# EAGLE design TickTag-UIB (EAGLE 9.5.2)
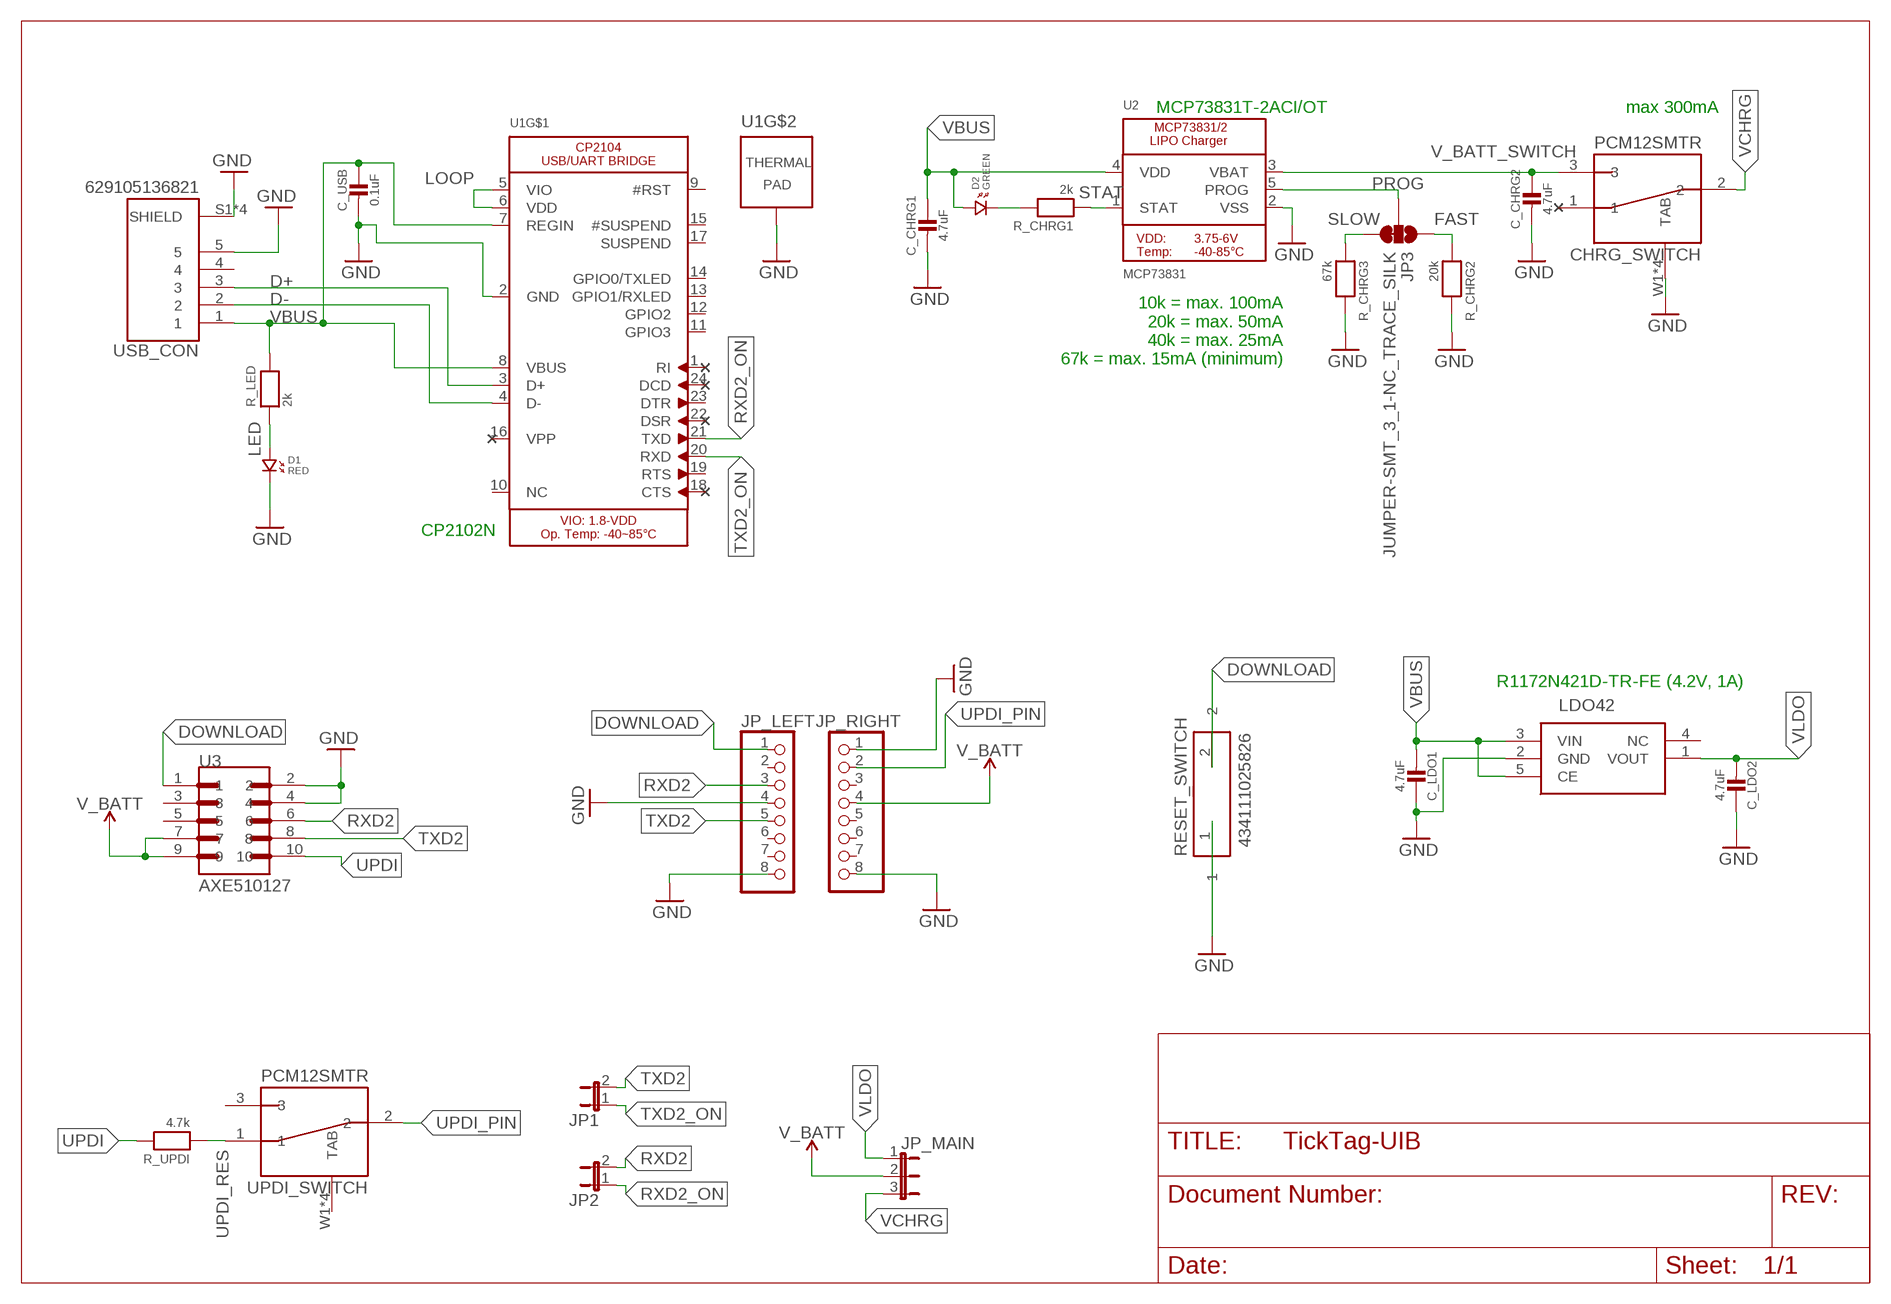
[diagram p0: schematic, sheet 1]

## Parts
C_CHRG1  4.7uF  MICROBUILDER_CAP_CERAMIC_0402MP  [MICROBUILDER__0402MP]
C_CHRG2  4.7uF  MICROBUILDER_CAP_CERAMIC_0402MP  [MICROBUILDER__0402MP]
C_LDO1  4.7uF  MICROBUILDER_CAP_CERAMIC_0402MP  [MICROBUILDER__0402MP]
C_LDO2  4.7uF  MICROBUILDER_CAP_CERAMIC_0402MP  [MICROBUILDER__0402MP]
C_USB  0.1uF  MICROBUILDER_CAP_CERAMIC_0402MP  [MICROBUILDER__0402MP]
CHRG_SWITCH  PCM12SMTR  AS-ITM-00220  [PCM12SMTR]
D1  RED  CMONR_STANDARDPARTS_LED.0402  [CMONR_STANDARDPARTS_0402.LED]
D2  GREEN  CMONR_STANDARDPARTS_LED.0402  [CMONR_STANDARDPARTS_0402.LED]
JP1  JP1E  [JP1]
JP2  JP1E  [JP1]
JP3  JUMPER-SMT_3_1-NC_TRACE_SILK  [SMT-JUMPER_3_1-NC_TRACE_SILK]
JP_LEFT  PINHD-1X8BIG  [1X08-BIG]
JP_MAIN  JP2E  [JP2]
JP_RIGHT  PINHD-1X8BIG  [1X08-BIG]
LDO42  R1172N421D-TR-FE  [R1172N421D-TR-FE]
R_CHRG1  2k  MICROBUILDER_RESISTOR_0402MP  [MICROBUILDER__0402MP]
R_CHRG2  20k  MICROBUILDER_RESISTOR_0402MP  [MICROBUILDER__0402MP]
R_CHRG3  67k  MICROBUILDER_RESISTOR_0402MP  [MICROBUILDER__0402MP]
R_LED  2k  MICROBUILDER_RESISTOR_0402MP  [MICROBUILDER__0402MP]
R_UPDI  4.7k  MICROBUILDER_RESISTOR_0402MP  [MICROBUILDER__0402MP]
RESET_SWITCH  434111025826  [434111025826]
U1  CP2104_MICROBUILDER_CP2104  [CP2104_MICROBUILDER_QFN24_4MM_SMSC]
U2  MCP73831  MICROBUILDER_MCP73831/2  [MICROBUILDER_SOT23-5]
U3  AXE510127  [AXE510127]
UPDI_SWITCH  PCM12SMTR  AS-ITM-00220  [PCM12SMTR]
USB_CON  629105136821  [WE_629105136821]

## Nets
D+: U1.3(D+) USB_CON.3
D-: U1.4(D-) USB_CON.2
DOWNLOAD: JP_LEFT.1 RESET_SWITCH.2 U3.1
FAST: JP3.1 R_CHRG2.1
GND: C_CHRG1.2 C_CHRG2.2 C_LDO1.1 C_LDO2.1 C_USB.2 CHRG_SWITCH.W1(TAB) CHRG_SWITCH.W2(TAB) CHRG_SWITCH.W3(TAB) CHRG_SWITCH.W4(TAB) D1.P$2 JP_LEFT.4 JP_LEFT.8 JP_RIGHT.1 JP_RIGHT.8 LDO42.2(GND) R_CHRG2.2 R_CHRG3.2 RESET_SWITCH.1 U1.2(GND) U1.THERM(TP) U2.2(VSS) U3.2 U3.4 USB_CON.5 USB_CON.S1(SHIELD) USB_CON.S2(SHIELD) USB_CON.S3(SHIELD) USB_CON.S4(SHIELD)
LED: D1.P$1 R_LED.1
LOOP: U1.5(VIO) U1.6(VDD)
PROG: JP3.2 U2.5(PROG)
RXD2: JP2.2 JP_LEFT.3 U3.6
RXD2_ON: JP2.1 U1.21(TXD)
SLOW: JP3.3 R_CHRG3.1
STAT: R_CHRG1.1 U2.1(STAT)
STAT_BTW: D2.P$2 R_CHRG1.2
TXD2: JP1.2 JP_LEFT.5 U3.8
TXD2_ON: JP1.1 U1.20(RXD)
UPDI: R_UPDI.2 U3.10
UPDI_PIN: JP_RIGHT.2 UPDI_SWITCH.2
UPDI_RES: R_UPDI.1 UPDI_SWITCH.1
V_BATT: JP_MAIN.2 JP_RIGHT.4 U3.7 U3.9
V_BATT_SWITCH: C_CHRG2.1 CHRG_SWITCH.3 U2.3(VBAT)
VBUS: C_CHRG1.1 C_LDO1.2 C_USB.1 D2.P$1 LDO42.3(VIN) LDO42.5(CE) R_LED.2 U1.7(REGIN) U1.8(VBUS) U2.4(VDD) USB_CON.1
VCHRG: CHRG_SWITCH.2 JP_MAIN.3
VLDO: C_LDO2.2 JP_MAIN.1 LDO42.1(VOUT)
Unconnected: CHRG_SWITCH.1 JP_LEFT.2 JP_LEFT.6 JP_LEFT.7 JP_RIGHT.3 JP_RIGHT.5 JP_RIGHT.6 JP_RIGHT.7 LDO42.4(NC) U1.1(RI) U1.9(#RST) U1.10(NC) U1.11(GPIO3) U1.12(GPIO2) U1.13(GPIO1/RXLED) U1.14(GPIO0/TXLED) U1.15(#SUSPEND) U1.16(VPP) U1.17(SUSPEND) U1.18(CTS) U1.19(RTS) U1.22(DSR) U1.23(DTR) U1.24(DCD) U3.3 U3.5 UPDI_SWITCH.3 UPDI_SWITCH.W1(TAB) UPDI_SWITCH.W2(TAB) UPDI_SWITCH.W3(TAB) UPDI_SWITCH.W4(TAB) USB_CON.4

## Notes on the sheet
- MCP73831T-2ACI/OT | max 300mA
- 10k = max. 100mA
  20k = max. 50mA
  40k = max. 25mA
  67k = max. 15mA (minimum)
- CP2102N
- R1172N421D-TR-FE (4.2V, 1A)

## Library data of the parts
C_CHRG1 C_CHRG2 C_LDO1 C_LDO2 C_USB = TinyPICO:MICROBUILDER_CAP_CERAMIC: Ceramic Capacitors For new designs, use the packages preceded by an '_' character since they are more reliable: The following footprints should be used on most boards: _0402 - Standard footprint for regular board layouts _0603 - Standard footprint for regular board layouts _0805 - Standard footprint for regular board layouts _1206 - Standard footprint for regular board layouts For extremely tight-pitch boards where space is at a premium, the following 'micro-pitch' footprints can be used (smaller pads, no silkscreen outline, etc.): _0402MP - Micro-pitch footprint for very dense/compact boards _0603MP - Micro-pitch footprint for very dense/compact boards _0805MP - Micro-pitch footprint for very dense/compact boards _1206MP - Micro-pitch footprint for very dense/compact boards
CHRG_SWITCH UPDI_SWITCH = tinycircuits:AS-ITM-00220: SW SLIDE SP2T 6VDC 0.3A SMT; PARTNO: AS-ITM-00220
D1 D2 = TinyPICO:CMONR_STANDARDPARTS_LED
JP1 JP2 = jumper:JP1E: JUMPER
JP3 = SparkFun-Jumpers:JUMPER-SMT_3_1-NC_TRACE: Normally closed trace jumper (1 of 2 connections) This jumper has a trace between two pads so it's normally closed (NC). The other connection is normally open (NO). Use a razor knife to open the connection. For best results follow the IPC guidelines for cutting traces: Cutout at least 0.063 mm (0.005 in). Remove all loose material to clean up the cut area. Seal the cut with an approved epoxy. Reapply solder to reclose the connection, or to close the NO connection.
JP_LEFT JP_RIGHT = adafruit:PINHD-1X8: PIN HEADER
JP_MAIN = jumper:JP2E: JUMPER
LDO42 = R1172N421D-TR-FE:R1172N421D-TR-FE: Low Dropout Regulators(LDO) SOT-23-5 RoHS Source: Datasheet <https://datasheet.lcsc.com/szlcsc/1809291540_Holtek-Semicon-HT7833_C164106.pdf>; DESCRIPTION: Low Dropout Regulators(LDO) SOT-23-5 RoHS; HEIGHT: 0.8mm; MANUFACTURER_NAME: Holtek; MANUFACTURER_PART_NUMBER: HT7833
R_CHRG1-R_CHRG3 R_LED R_UPDI = TinyPICO:MICROBUILDER_RESISTOR: Resistors 0402 - 0402 Surface Mount Package 22 Ohm 1% 1/16W [Digikey: 311-22.0LRTR-ND] 33 Ohm 5% 1/16W 1.0K 5% 1/16W 1.5K 5% 1/16W 2.0K 1% 1/16W 10.0K 1% 1/16W [Digikey: 311-10.0KLRTR-ND] 10.0K 5% 1/16W [Digikey: RMCF0402JT10K0TR-ND] 12.1K 1% 1/16W [Digikey: 311-22.0LRTR-ND] 100.0K 5% 1/16W 0603 - 0603 Surface Mount Package 0 Ohm 1/10 Watt 1% Resistor 15 Ohm 1/10 Watt 1% Resistor 33 Ohm 1/10 Watt 1% Resistor 49.9 Ohm 1/10 Watt 1% Resistor 100 Ohm 1/10 Watt 1% Resistor 150 Ohm 1/10 Watt 1% Resistor 240 Ohm 1/10 Watt 1% Resistor 390 Ohm 1/10 Watt 1% Resistor 560 Ohm 1/10 Watt 1% Resistor 680 Ohm 1/10 Watt 1% Resistor 750 Ohm 1/10 Watt 1% Resistor 1.0K Ohm 1/10 Watt 1% Resistor 1.5K Ohm 1/10 Watt 1% Resistor 2.0K Ohm 1/10 Watt 1% Resistor 2.2K Ohm 1/10 Watt 1% Resistor 3.3K Ohm 1/10 Watt 1% Resistor 4.7K Ohm 1/10 Watt 1% Resistor 10.0K Ohm 1/10 Watt 1% Resistor 12.0K Ohm 1/10 Watt 1% Resistor 12.1K Ohm 1/10 Watt 1% Resistor 20.0K Ohm 1/10 Watt 1% Resistor 33.0K Ohm 1/10 Watt 1% Resistor 100.0K Ohm 1/10 Watt 1% Resistor 0805 - 0805 Surface Mount Package 0 Ohm 1/8 Watt 1% Resistor 33 Ohm 1/8 Watt 1% Resistor 100 Ohm 1/8 Watt 1% Resistor 150 Ohm 1/8 Watt 1% Resistor 200 Ohm 1/8 Watt 1% Resistor 240 Ohm 1/8 Watt 1% Resistor 330 Ohm 1/8 Watt 1% Resistor 390 Ohm 1/8 Watt 1% Resistor 470 Ohm 1/8 Watt 1% Resistor 1.0K Ohm 1/8 Watt 1% Resistor 1.5K Ohm 1/8 Watt 1% Resistor 2.0K Ohm 1/8 Watt 1% Resistor 4.7K Ohm 1/8 Watt 1% Resistor 5.1K Ohm 1/8 Watt 1% Resistor 5.6K Ohm 1/8 Watt 1% Resistor 10.0K Ohm 1/8 Watt 1% Resistor 22.0K Ohm 1/8 Watt 1% Resistor 33.0K Ohm 1/8 Watt 1% Resistor 100K Ohm 1/8 Watt 1% Resistor 1206 - 1206 Surface Mount Package 2012 - 2010 Surface Mount Package 0.11 Ohm 1/2 Watt 1% Resistor - Digikey: RHM.11UCT-ND
RESET_SWITCH = Wurth_Elektronik_Electromechanic_Switchs_rev15b:434111025826: WS-TRS-6x3.8 mm SMD Tact Switch, 2 pins
U1 = TinyPICO:CP2104_MICROBUILDER_CP2104: CP2104 - USB to UART Bridge VDD Output: 3.45V
U2 = TinyPICOV2:MICROBUILDER_MCP73831/2: MCP73831/2 LIPO Charger VDD: 3.75 - 6V Temp -40 - 85°C Programmable Charge Rate: 15-500mA NOTE: STAT is a tri-state logic output on the MCP73831 and an open-drain output on the MCP73832. SOT23-5 with 4.2V output and tri-state logic on STAT = MCP73831T-2ACI/OT
U3 = PanasonicA4SConnectorsV4_CreamAdjust:AXE510127
USB_CON = 629105136821:629105136821: WR-COM SMT Horizontal 5 Contacts Micro USB Type B,5 pins; AVAILABILITY: Unavailable; DESCRIPTION: USB - micro B USB 2.0 Receptacle Connector 5 Position Surface Mount, Right Angle; MF: Wurth Electronics; MP: 629105136821; PACKAGE: None; PRICE: None

## Board
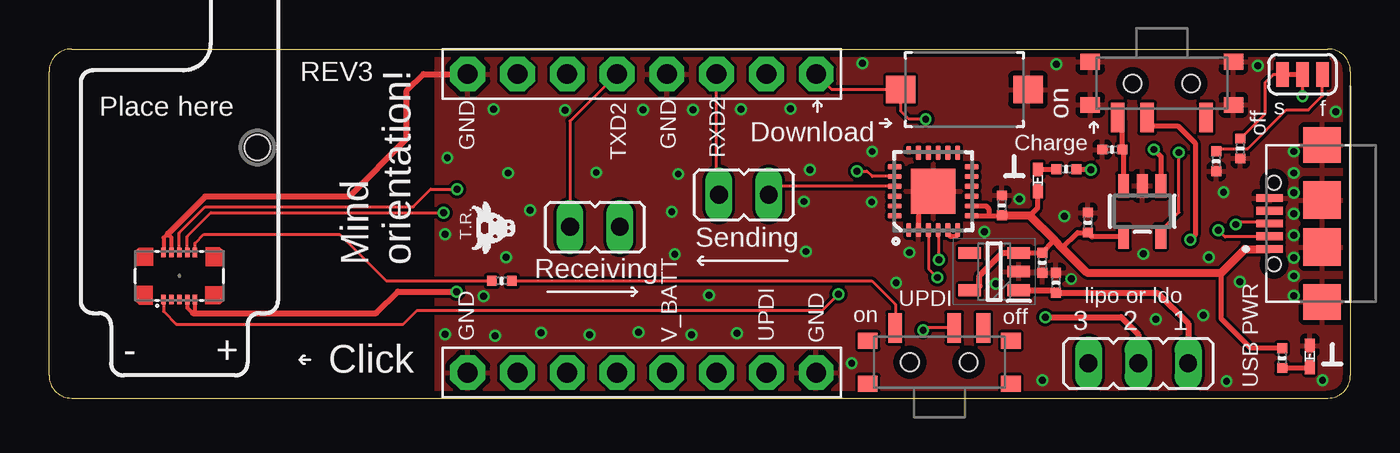
[diagram p1: board, top side]
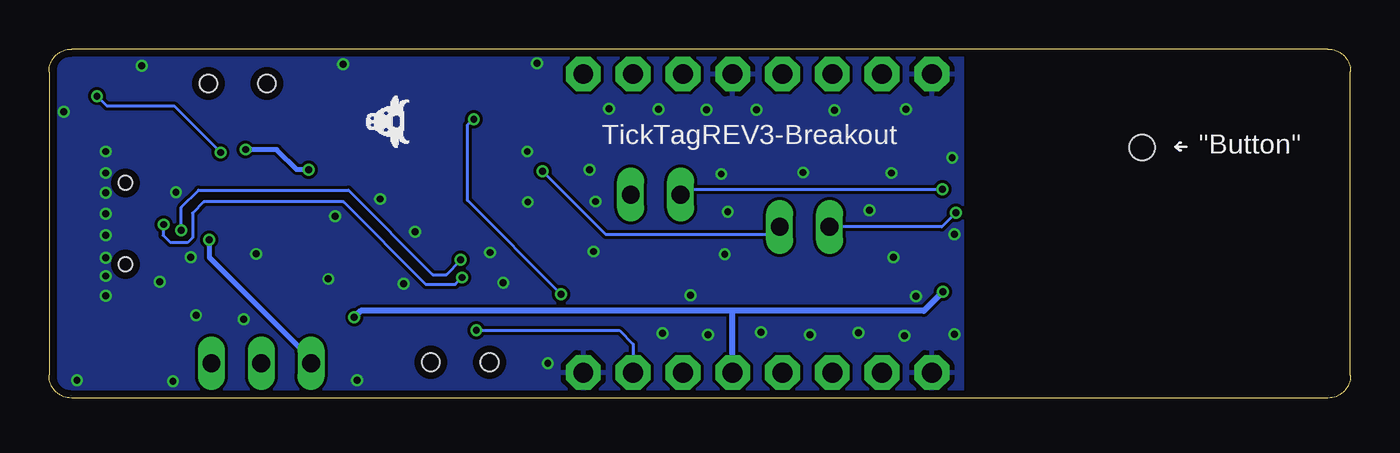
[diagram p2: board, bottom side, seen from below]

Size 66.4 x 17.8 mm. Coordinates in mm from the lower left corner, seen from the top.
Outline: 1.15,0 65.25,0 arc90 66.4,1.15 66.4,16.65 arc90 65.25,17.8 1.15,17.8 arc90 0,16.65 0,1.15 arc90 1.15,0
Copper layers (1*16): Top 0.035559375mm / dielectric 1.6mm / Bottom 0.035559375mm
Design rules "oshpark-2layer *": minimum track width 6mil, minimum drill 0.008890625mm, track to track 6mil, track to pad 6mil, pad to pad 6mil, via to via 6mil, smd to smd 6mil, copper to edge 15mil, drill to drill 6mil, minimum pad ring 5mil, minimum via ring 5mil, stop-mask expansion 0mil, vias tented up to drill 12mil, thermal gap 10mil
Holes 1.3 mm at 10.62,12.78

### Footprints (pad centres in the part's own frame; a part is rotated, then mirrored left to right if it is on the bottom)
MICROBUILDER__0402MP = smd 0.5 x 0.5: 1 -0.508,0; 2 0.508,0
PCM12SMTR = smd 0.7 x 1.5: 1 -2.25,1.75; 2 0.75,1.75; 3 2.25,1.75 | smd 1 x 0.8: W1 -3.65,1.1; W2 -3.65,-1.1; W3 3.65,-1.1; W4 3.65,1.1 | hole 0.9: 1.5,0; -1.5,0
CMONR_STANDARDPARTS_0402.LED = smd 0.7 x 0.5: P$1 -0.55,0; P$2 0.55,0
JP1 = drill 0.914 long: 1 0,-1.27; 2 0,1.27
SMT-JUMPER_3_1-NC_TRACE_SILK = smd 0.635 x 1.27: 1 -1.016,0; 2 0,0; 3 1.016,0
1X08-BIG = drill 1.016 pad 1.778 octagon: 1 -8.89,0; 2 -6.35,0; 3 -3.81,0; 4 -1.27,0; 5 1.27,0; 6 3.81,0; 7 6.35,0; 8 8.89,0
JP2 = drill 0.914 long: 1 -2.54,0; 2 0,0; 3 2.54,0
R1172N421D-TR-FE = smd 1.15 x 0.6: 1 -1.25,0.95; 2 -1.25,0; 3 -1.25,-0.95; 4 1.25,-0.95; 5 1.25,0.95
434111025826 = smd 1.5 x 1.4: 1 -3.25,0; 2 3.25,0
CP2104_MICROBUILDER_QFN24_4MM_SMSC = smd 0.737 x 0.28: 1 -1.968,1.25; 2 -1.968,0.75; 3 -1.968,0.25; 4 -1.968,-0.25; 5 -1.968,-0.75; 6 -1.968,-1.25; 13 1.968,-1.25; 14 1.968,-0.75; 15 1.968,-0.25; 16 1.968,0.25; 17 1.968,0.75 | smd 0.28 x 0.737: 7 -1.25,-1.968; 8 -0.75,-1.968; 9 -0.25,-1.968; 10 0.25,-1.968; 11 0.75,-1.968; 12 1.25,-1.968; 19 1.25,1.968; 20 0.75,1.968; 21 0.25,1.968; 22 -0.25,1.968; 23 -0.75,1.968; 24 -1.25,1.968 | smd 0.457 x 0.28: 18 2.095,1.25 | smd 2.286 x 2.286: THERM 0,0
MICROBUILDER_SOT23-5 = smd 0.55 x 1.2: 1 -0.95,-1.3; 2 0,-1.3; 3 0.95,-1.3; 4 0.95,1.3; 5 -0.95,1.3
AXE510127 = smd 0.23 x 0.5: 1 -0.8,-1.2; 2 -0.8,1.2; 3 -0.4,-1.2; 4 -0.4,1.2; 5 0,-1.2; 6 0,1.2; 7 0.4,-1.2; 8 0.4,1.2; 9 0.8,-1.2; 10 0.8,1.2
WE_629105136821 = smd 0.4 x 1.35: 1 -1.3,2.675; 2 -0.65,2.675; 3 0,2.675; 4 0.65,2.675; 5 1.3,2.675 | smd 1.8 x 1.9: S1 -4,0; S4 4,0 | smd 1.9 x 1.9: S2 -1.2,0; S3 1.2,0 | hole 0.7: -2.075,2.45; 2.075,2.45

### Placement (x,y rotation side)
C_CHRG1  53,8.95 90 top
C_CHRG2  54.25,12.68 180 top
C_LDO1  50.67,6.9 90 top
C_LDO2  51.38,5.88 270 top
C_USB  48.62,9.83 90 top
CHRG_SWITCH  56.77,16.05 180 top
D1  64.33,2.12 90 top
D2  50.45,11.1 90 top
JP1  27.85,8.72 90 top
JP2  35.45,10.38 90 top
JP3  63.95,16.5 180 top
JP_LEFT  30.25,16.52 180 top
JP_MAIN  55.58,1.78 180 top
JP_RIGHT  30.25,1.3 180 top
LDO42  48.23,6.45 180 top
R_CHRG1  51.9,11.68 180 top
R_CHRG2  59.55,12.07 270 top
R_CHRG3  60.77,12.73 270 top
R_LED  62.91,2.04 90 top
R_UPDI  23.1,5.98 180 top
RESET_SWITCH  46.7,15.73 180 top
U1  45.11,10.54 90 top
U2  55.77,9.53 180 top
U3  6.65,6.23 0 top
UPDI_SWITCH  45.42,1.83 0 top
USB_CON  64.95,8.9 90 top

### Tracks (layer width: path | path; a pad name or v marks a point on that pad's centre or on a via)
D+  (via drill 0.35)
  Top 0.152: U1.3 44.87,8.57 44.87,6.61 v45.33,6.15 | v60.55,8.85 60.67,8.97 62.2,8.97 USB_CON.3
  Bottom 0.152: v45.33,6.15 45.67,5.8 47.17,5.8 51.38,10 58.5,10 59.08,9.43 59.08,8.18 59.33,7.93 60.2,7.93 60.58,8.3 60.58,8.83 v60.55,8.85
D-  (via drill 0.35)
  Top 0.152: USB_CON.2 62.25,8.22 60,8.22 59.67,8.55 v59.65,8.55 | v45.4,7.05 45.38,7.08 45.38,8.56 U1.4
  Bottom 0.152: v59.65,8.55 59.65,9.72 58.77,10.6 51.12,10.6 46.83,6.3 46.12,6.3 45.4,7.03 v45.4,7.05
DOWNLOAD  (via drill 0.35)
  Top 0.152: v40.27,5.3 39.45,4.48 18.77,4.48 18.07,3.78 6.5,3.78 5.85,4.43 U3.1 | v44.73,14.23 43.88,14.23 43.45,14.65 RESET_SWITCH.2 39.94,15.73 JP_LEFT.1
  Bottom 0.152: v40.27,5.3 45.05,10.08 45.05,13.93 44.75,14.23 v44.73,14.23
FAST
  Top 0.152: R_CHRG2.1 59.69,12.73 61.15,12.73 63.12,14.7 64.25,14.7 64.97,15.42 JP3.1
GND  (via drill 0.35)
  Top 0.2: U3.2 5.85,8.18 6.03,8.35 6.08,8.35 6.25,8.18 U3.4
  Top 0.254: U1.THERM 44.36,9.79 U1.2
  Top 0.305: JP_LEFT.8 19.1,16.52 18.25,15.68 18.25,13.23 15.3,10.28 7.96,10.28 6.08,8.39 6.08,8.35
  other vias: 63.5,11.48 63.5,10.47 63.5,9.4 63.5,8.3 63.5,7.15 63.5,6.23 63.5,12.57 63.5,5.23 20.2,8.35 23.32,7.18 22.18,5.2 33.67,5.25 20.32,12.25 23.43,11.48 32.1,11.43 27.93,11.5 35.3,14.73 32.85,14.7 30.3,14.7 37.83,14.75 26.32,14.68 22.68,14.73 24.55,9.58 31.77,9.5 31.93,7.33 52.15,6.08 38.83,11.65 42,12.57 41.98,10 38.62,7.48 38.52,10.03 40.95,1.78 35.1,3.3 32.77,3.23 30.07,3.35 27.57,3.23 25.1,3.33 20.2,3.25 22.75,3.18 60.75,5.93 64.97,0.9 60.08,0.85 59.92,10.5 59.17,7.18 55.83,7.35 51.8,9.28 49.5,10.15 47.73,8.47 48.3,5.83 43.9,7.43 43.23,5.88 50.67,0.9 61.67,16.95 65.65,14.6 41.5,17.08 51.4,17.02 58.9,4.23 56.48,4.03
  pour Top: 19.75,19.33 66.95,19.33 66.95,-1.55 19.75,-1.55
  pour Bottom: 67.28,19.48 19.8,19.48 19.8,-1.85 67.28,-1.85
LED
  Top 0.254: D1.P$1 64.28,1.53 R_LED.1
LOOP
  Top 0.254: U1.6 46.36,8.35 46.23,8.23 46.01,8.23 45.86,8.38 U1.5
PROG  (via drill 0.35)
  Top 0.152: U2.5 56.73,8.55 57.65,9.47 v57.65,12.53 | JP3.2 v63.95,15.4
  Bottom 0.152: v57.65,12.53 60.02,14.9 63.45,14.9 v63.95,15.4
RXD2  (via drill 0.35)
  Top 0.152: JP2.2 34.06,10.5 JP_LEFT.3 | U3.6 6.65,8.43 7.98,9.76 18.58,9.76 19.48,10.65 v20.82,10.65
  Bottom 0.152: JP2.2 33.91,10.65 v20.82,10.65
RXD2_ON
  Top 0.152: U1.21 37.14,10.79 JP2.1
SLOW
  Top 0.152: R_CHRG3.1 62.05,14.51 62.05,16.1 62.45,16.5 JP3.3
STAT  (via drill 0.35)
  Top 0.254: R_CHRG1.1 53.12,11.68 v53.15,11.65 | v56.38,12.68 56.73,12.32 U2.1
  Bottom 0.254: v53.15,11.65 53.75,11.65 54.77,12.68 v56.38,12.68
STAT_BTW
  Top 0.254: D2.P$2 50.48,11.68 R_CHRG1.2
TXD2  (via drill 0.35)
  Top 0.152: JP_LEFT.5 26.58,14.12 JP1.2 | U3.8 7.05,8.25 8.25,9.45 v20.12,9.45
  Bottom 0.152: v20.12,9.45 20.85,8.72 JP1.2
TXD2_ON  (via drill 0.35)
  Top 0.152: v41.23,11.57 41.73,11.57 42,11.3 U1.20
  Bottom 0.152: JP1.1 29.5,8.35 38,8.35 v41.23,11.57
UPDI
  Top 0.152: U3.10 7.45,7.9 7.9,8.35 14.82,8.35 17.2,5.98 R_UPDI.2
UPDI_PIN  (via drill 0.35)
  Top 0.152: UPDI_SWITCH.2 44.73,3.58 v44.6,3.45
  Bottom 0.152: v44.6,3.45 37.3,3.45 36.6,2.75 JP_RIGHT.2
UPDI_RES
  Top 0.152: R_UPDI.1 41.98,5.98 43.17,4.78 UPDI_SWITCH.1
V_BATT  (via drill 0.35)
  Top 0.2: U3.7 7.05,4.6 7.31,4.34 7.34,4.34 7.45,4.45 U3.9
  Top 0.305: v50.83,4.12 54.7,4.12 55.58,3.25 JP_MAIN.2 | 7.34,4.34 7.35,4.33 16.7,4.33 17.8,5.43 v20.8,5.43
  Bottom 0.305: v20.8,5.43 21.77,4.45 31.52,4.45 | v50.83,4.12 50.5,4.45 31.52,4.45 | JP_RIGHT.4 31.52,4.45
V_BATT_SWITCH
  Top 0.254: U2.3 54.83,12.61 C_CHRG2.1 54.76,14.07 CHRG_SWITCH.3
VBUS
  Top 0.254: U1.7 47.95,9.29 | 50.04,9.31 50.45,9.72 D2.P$1 | R_LED.2 61.31,2.54 59.8,4.05 59.8,6.4 | U1.8 47.8,9.79 47.8,9.8 47.95,9.65 47.95,9.29 | 51.69,7.66 52.47,8.44 C_CHRG1.1 53.22,8.22 U2.4 | 47.95,9.29 48.61,9.29 48.62,9.31 | 51.34,8.01 51.28,8.01 C_LDO1.2 LDO42.3
  Top 0.305: LDO42.5 47.25,5.5 47.48,5.73 47.48,6.24 48.63,7.4 LDO42.3
  Top 0.406: USB_CON.1 61,7.6 59.8,6.4 52.95,6.4 51.69,7.66 51.34,8.01 50.04,9.31 | 50.04,9.31 48.62,9.31 C_USB.1
VCHRG  (via drill 0.35)
  Top 0.254: v58.23,8.08 58.48,8.33 58.48,13 57.62,13.85 56.3,13.85 56.02,14.12 CHRG_SWITCH.2
  Bottom 0.254: v58.23,8.08 58.23,7.18 53.02,1.98 53.02,1.79 JP_MAIN.3
VLDO
  Top 0.305: LDO42.1 51.24,5.5 C_LDO2.2 56.56,5.37 58.12,3.81 JP_MAIN.1

### Text on the board
tNames: REV3 | s | f | Place here | on | Charge | GND | GND | Download | off | TXD2 | RXD2 | T.R. | Sending | Mind / orientation! | Receiving | UPDI | lipo or ldo | on | off | GND | V_BATT | UPDI | GND | - | + | Click | USB PWR
bNames: TickTagREV3-Breakout | "Button"